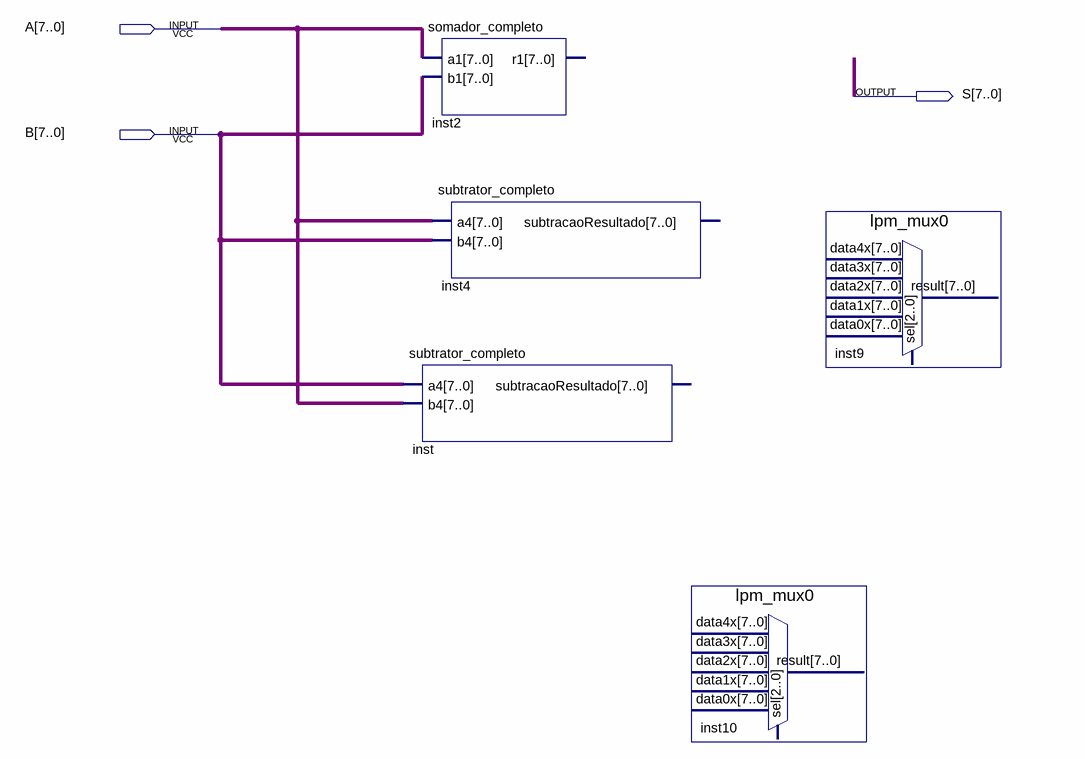
[diagram p0: schematic sheet]
// Quartus schematic d.bdf as structural Verilog: 5 symbols, 3 pins
module d (
  input  [7:0] A,
  input  [7:0] B,
  output [7:0] S
);

  somador_completo inst2 (.a1(A), .b1(B));  // open: r1
  subtrator_completo inst4 (.a4(A), .b4(B));  // open: subtracaoResultado
  subtrator_completo inst (.a4(B), .b4(A));  // open: subtracaoResultado
  lpm_mux0 inst10 ();  // open: data4x, data3x, data2x, data1x, data0x, sel, result
  lpm_mux0 inst9 ();  // open: data4x, data3x, data2x, data1x, data0x, sel, result
endmodule
